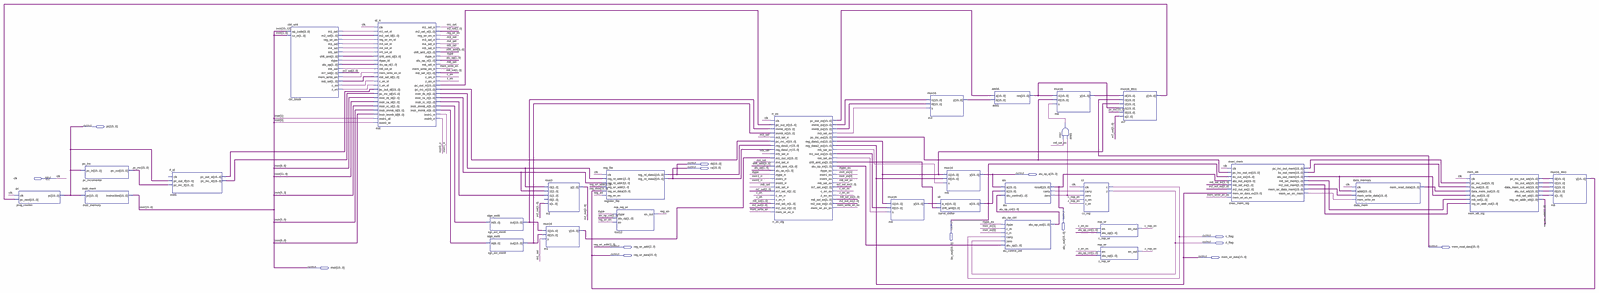
[diagram p0: schematic sheet, whole]
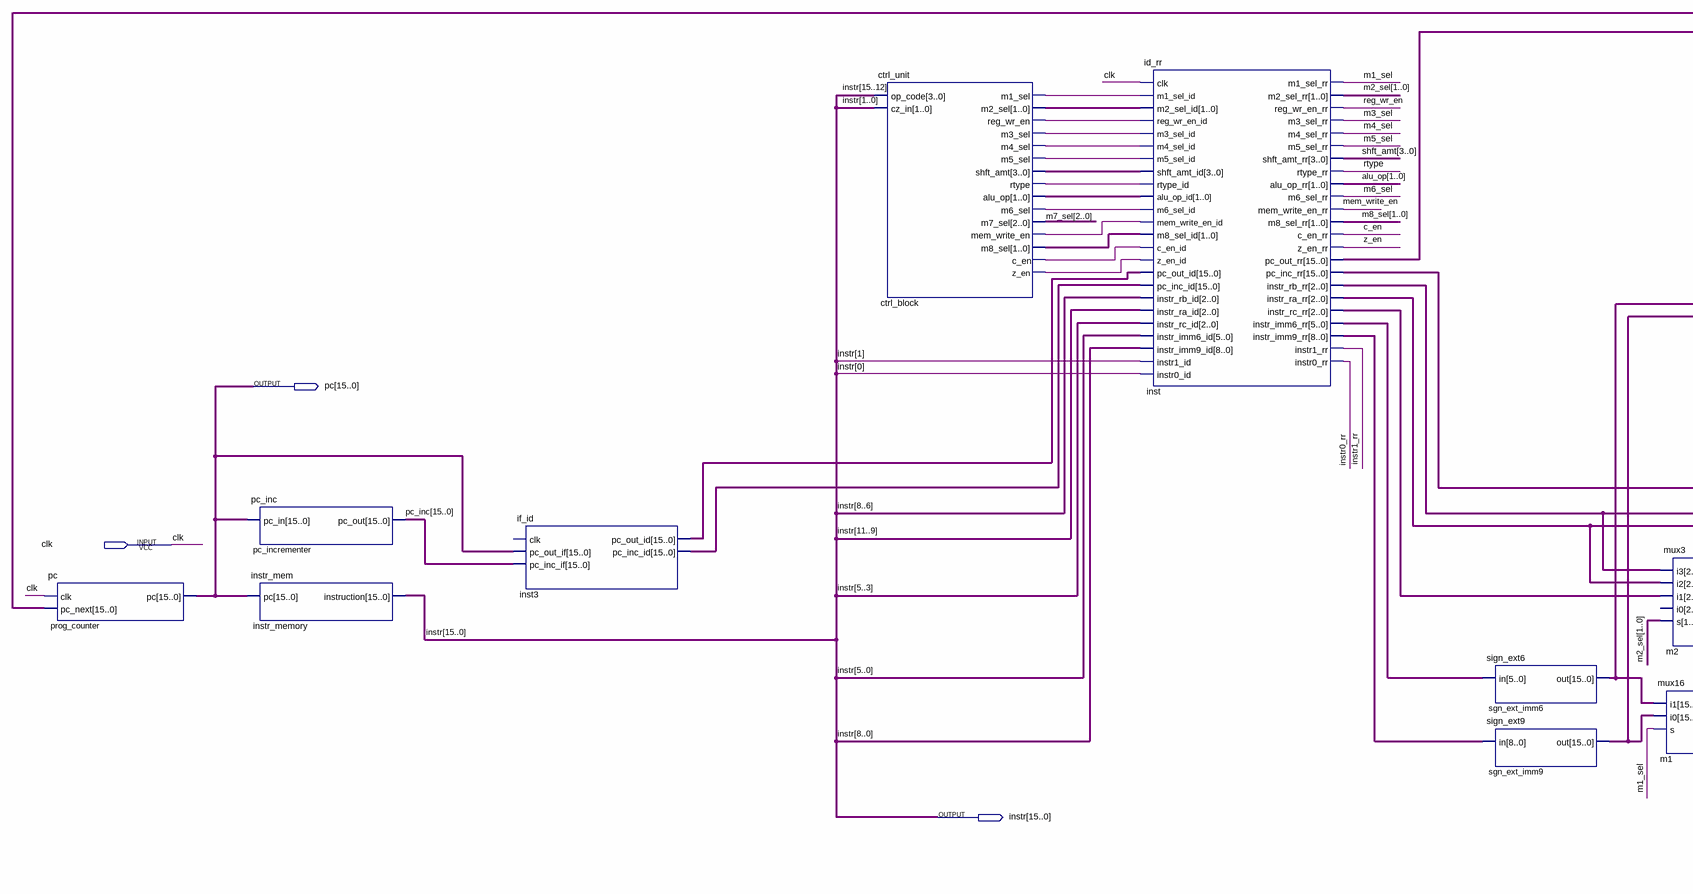
[diagram p1: schematic sheet, left part]
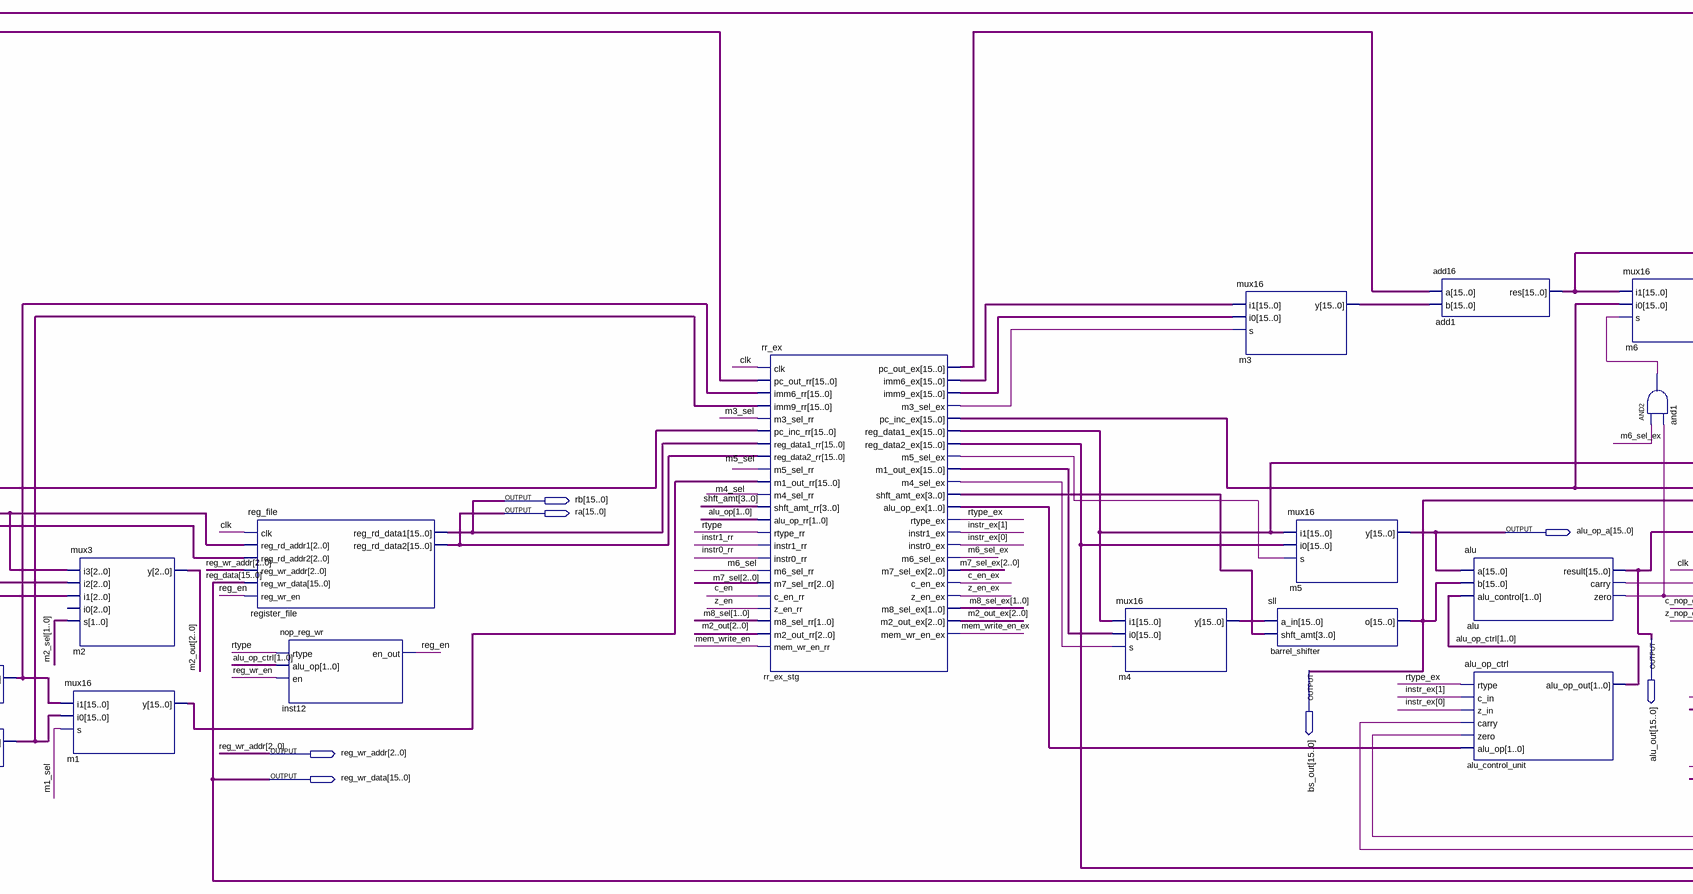
[diagram p2: schematic sheet, centre part]
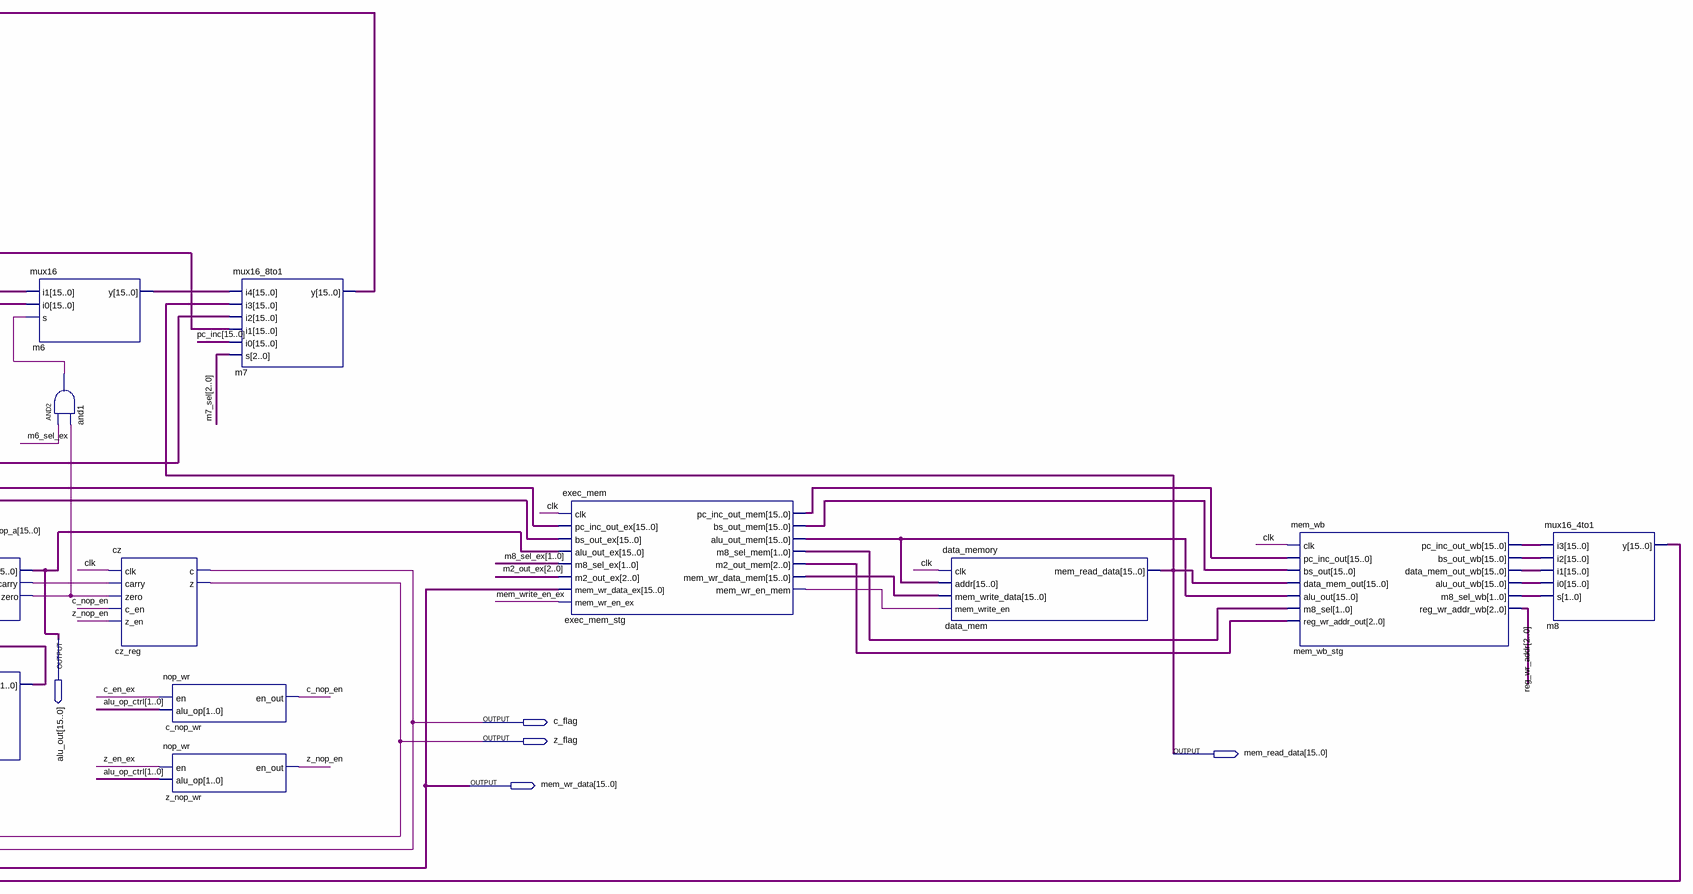
[diagram p3: schematic sheet, right part]
// Quartus schematic pd_project1.bdf as structural Verilog: 30 symbols, 14 pins
module pd_project1 (
  input  clk,
  output [15:0] pc,
  output [15:0] rb,
  output [15:0] ra,
  output [15:0] alu_op_a,
  output [15:0] alu_out,
  output [15:0] bs_out,
  output c_flag,
  output z_flag,
  output [2:0] reg_wr_addr,
  output [15:0] mem_read_data,
  output [15:0] reg_wr_data,
  output [15:0] mem_wr_data,
  output [15:0] instr
);

  wire alu_carry, alu_zero, and1_out, c_en, c_en_ex, c_nop_en, ctrl_block_c_en, ctrl_block_m1_sel,
       ctrl_block_m3_sel, ctrl_block_m4_sel, ctrl_block_m5_sel, ctrl_block_m6_sel, ctrl_block_mem_write_en,
       ctrl_block_reg_wr_en, ctrl_block_rtype, ctrl_block_z_en, exec_mem_stg_mem_wr_en_mem, instr0_rr,
       instr1_rr, m1_sel, m3_sel, m4_sel, m5_sel, m6_sel, m6_sel_ex, mem_write_en, mem_write_en_ex, reg_en,
       reg_wr_en, rr_ex_stg_m3_sel_ex, rr_ex_stg_m4_sel_ex, rr_ex_stg_m5_sel_ex, rtype, rtype_ex, z_en,
       z_en_ex, z_nop_en;
  wire [1:0] alu_op, alu_op_ctrl, ctrl_block_alu_op, ctrl_block_m2_sel, ctrl_block_m8_sel,
       exec_mem_stg_m8_sel_mem, instr_ex, m2_sel, m8_sel, m8_sel_ex, mem_wb_stg_m8_sel_wb,
       rr_ex_stg_alu_op_ex;
  wire [2:0] exec_mem_stg_m2_out_mem, inst_instr_ra_rr, inst_instr_rb_rr, inst_instr_rc_rr, m2_out,
       m2_out_ex, m7_sel, m7_sel_ex;
  wire [3:0] ctrl_block_shft_amt, rr_ex_stg_shft_amt_ex, shft_amt;
  wire [5:0] inst_instr_imm6_rr;
  wire [8:0] inst_instr_imm9_rr;
  wire [15:0] add1_res, exec_mem_stg_alu_out_mem, exec_mem_stg_bs_out_mem, exec_mem_stg_mem_wr_data_mem,
       exec_mem_stg_pc_inc_out_mem, inst3_pc_inc_id, inst3_pc_out_id, inst_pc_inc_rr, inst_pc_out_rr, m1_y,
       m3_y, m4_y, m6_y, m7_y, mem_wb_stg_alu_out_wb, mem_wb_stg_bs_out_wb, mem_wb_stg_data_mem_out_wb,
       mem_wb_stg_pc_inc_out_wb, pc_inc, rr_ex_stg_imm6_ex, rr_ex_stg_imm9_ex, rr_ex_stg_m1_out_ex,
       rr_ex_stg_pc_inc_ex, rr_ex_stg_pc_out_ex, rr_ex_stg_reg_data1_ex, sgn_ext_imm6_out, sgn_ext_imm9_out;

  pc prog_counter (.clk(clk), .pc_next(m7_y), .pc(pc));
  pc_inc pc_incrementer (.pc_in(pc), .pc_out(pc_inc));
  instr_mem instr_memory (.pc(pc), .instruction(instr));
  if_id inst3 (
    .pc_out_if(pc), .pc_inc_if(pc_inc), .pc_out_id(inst3_pc_out_id), .pc_inc_id(inst3_pc_inc_id));  // open: clk
  ctrl_unit ctrl_block (
    .op_code(instr[15:12]), .cz_in(instr[1:0]), .m1_sel(ctrl_block_m1_sel), .m2_sel(ctrl_block_m2_sel),
    .reg_wr_en(ctrl_block_reg_wr_en), .m3_sel(ctrl_block_m3_sel), .m4_sel(ctrl_block_m4_sel),
    .m5_sel(ctrl_block_m5_sel), .shft_amt(ctrl_block_shft_amt), .rtype(ctrl_block_rtype),
    .alu_op(ctrl_block_alu_op), .m6_sel(ctrl_block_m6_sel), .m7_sel(m7_sel),
    .mem_write_en(ctrl_block_mem_write_en), .m8_sel(ctrl_block_m8_sel), .c_en(ctrl_block_c_en),
    .z_en(ctrl_block_z_en));
  id_rr inst (
    .clk(clk), .m1_sel_id(ctrl_block_m1_sel), .m2_sel_id(ctrl_block_m2_sel),
    .reg_wr_en_id(ctrl_block_reg_wr_en), .m3_sel_id(ctrl_block_m3_sel), .m4_sel_id(ctrl_block_m4_sel),
    .m5_sel_id(ctrl_block_m5_sel), .shft_amt_id(ctrl_block_shft_amt), .rtype_id(ctrl_block_rtype),
    .alu_op_id(ctrl_block_alu_op), .m6_sel_id(ctrl_block_m6_sel), .mem_write_en_id(ctrl_block_mem_write_en),
    .m8_sel_id(ctrl_block_m8_sel), .c_en_id(ctrl_block_c_en), .z_en_id(ctrl_block_z_en),
    .pc_out_id(inst3_pc_out_id), .pc_inc_id(inst3_pc_inc_id), .instr_rb_id(instr[8:6]),
    .instr_ra_id(instr[11:9]), .instr_rc_id(instr[5:3]), .instr_imm6_id(instr[5:0]),
    .instr_imm9_id(instr[8:0]), .instr1_id(instr[1]), .instr0_id(instr[0]), .m1_sel_rr(m1_sel),
    .m2_sel_rr(m2_sel), .reg_wr_en_rr(reg_wr_en), .m3_sel_rr(m3_sel), .m4_sel_rr(m4_sel), .m5_sel_rr(m5_sel),
    .shft_amt_rr(shft_amt), .rtype_rr(rtype), .alu_op_rr(alu_op), .m6_sel_rr(m6_sel),
    .mem_write_en_rr(mem_write_en), .m8_sel_rr(m8_sel), .c_en_rr(c_en), .z_en_rr(z_en),
    .pc_out_rr(inst_pc_out_rr), .pc_inc_rr(inst_pc_inc_rr), .instr_rb_rr(inst_instr_rb_rr),
    .instr_ra_rr(inst_instr_ra_rr), .instr_rc_rr(inst_instr_rc_rr), .instr_imm6_rr(inst_instr_imm6_rr),
    .instr_imm9_rr(inst_instr_imm9_rr), .instr1_rr(instr1_rr), .instr0_rr(instr0_rr));
  sign_ext6 sgn_ext_imm6 (.in(inst_instr_imm6_rr), .out(sgn_ext_imm6_out));
  sign_ext9 sgn_ext_imm9 (.in(inst_instr_imm9_rr), .out(sgn_ext_imm9_out));
  mux3 m2 (.i3(inst_instr_rb_rr), .i2(inst_instr_ra_rr), .i1(inst_instr_rc_rr), .s(m2_sel), .y(m2_out));  // open: i0
  mux16 m1 (.i1(sgn_ext_imm6_out), .i0(sgn_ext_imm9_out), .s(m1_sel), .y(m1_y));
  reg_file register_file (
    .clk(clk), .reg_rd_addr1(inst_instr_rb_rr), .reg_rd_addr2(inst_instr_ra_rr), .reg_wr_addr(reg_wr_addr),
    .reg_wr_data(reg_wr_data), .reg_wr_en(reg_en), .reg_rd_data1(rb), .reg_rd_data2(ra));
  nop_reg_wr inst12 (.rtype(rtype), .alu_op(alu_op_ctrl), .en(reg_wr_en), .en_out(reg_en));
  rr_ex rr_ex_stg (
    .clk(clk), .pc_out_rr(inst_pc_out_rr), .imm6_rr(sgn_ext_imm6_out), .imm9_rr(sgn_ext_imm9_out),
    .m3_sel_rr(m3_sel), .pc_inc_rr(inst_pc_inc_rr), .reg_data1_rr(rb), .reg_data2_rr(ra), .m5_sel_rr(m5_sel),
    .m1_out_rr(m1_y), .m4_sel_rr(m4_sel), .shft_amt_rr(shft_amt), .alu_op_rr(alu_op), .rtype_rr(rtype),
    .instr1_rr(instr1_rr), .instr0_rr(instr0_rr), .m6_sel_rr(m6_sel), .m7_sel_rr(m7_sel), .c_en_rr(c_en),
    .z_en_rr(z_en), .m8_sel_rr(m8_sel), .m2_out_rr(m2_out), .mem_wr_en_rr(mem_write_en),
    .pc_out_ex(rr_ex_stg_pc_out_ex), .imm6_ex(rr_ex_stg_imm6_ex), .imm9_ex(rr_ex_stg_imm9_ex),
    .m3_sel_ex(rr_ex_stg_m3_sel_ex), .pc_inc_ex(rr_ex_stg_pc_inc_ex), .reg_data1_ex(rr_ex_stg_reg_data1_ex),
    .reg_data2_ex(mem_wr_data), .m5_sel_ex(rr_ex_stg_m5_sel_ex), .m1_out_ex(rr_ex_stg_m1_out_ex),
    .m4_sel_ex(rr_ex_stg_m4_sel_ex), .shft_amt_ex(rr_ex_stg_shft_amt_ex), .alu_op_ex(rr_ex_stg_alu_op_ex),
    .rtype_ex(rtype_ex), .instr1_ex(instr_ex[1]), .instr0_ex(instr_ex[0]), .m6_sel_ex(m6_sel_ex),
    .m7_sel_ex(m7_sel_ex), .c_en_ex(c_en_ex), .z_en_ex(z_en_ex), .m8_sel_ex(m8_sel_ex),
    .m2_out_ex(m2_out_ex), .mem_wr_en_ex(mem_write_en_ex));
  mux16 m4 (.i1(rr_ex_stg_reg_data1_ex), .i0(rr_ex_stg_m1_out_ex), .s(rr_ex_stg_m4_sel_ex), .y(m4_y));
  mux16 m3 (.i1(rr_ex_stg_imm6_ex), .i0(rr_ex_stg_imm9_ex), .s(rr_ex_stg_m3_sel_ex), .y(m3_y));
  mux16 m5 (.i1(rr_ex_stg_reg_data1_ex), .i0(mem_wr_data), .s(rr_ex_stg_m5_sel_ex), .y(alu_op_a));
  sll barrel_shifter (.a_in(m4_y), .shft_amt(rr_ex_stg_shft_amt_ex), .o(bs_out));
  add16 add1 (.a(rr_ex_stg_pc_out_ex), .b(m3_y), .res(add1_res));
  alu alu (.a(alu_op_a), .b(bs_out), .alu_control(alu_op_ctrl), .result(alu_out), .carry(alu_carry), .zero(alu_zero));
  alu_op_ctrl alu_control_unit (
    .rtype(rtype_ex), .c_in(instr_ex[1]), .z_in(instr_ex[0]), .carry(c_flag), .zero(z_flag),
    .alu_op(rr_ex_stg_alu_op_ex), .alu_op_out(alu_op_ctrl));
  mux16 m6 (.i1(add1_res), .i0(rr_ex_stg_pc_inc_ex), .s(and1_out), .y(m6_y));
  and and1 (and1_out, m6_sel_ex, alu_zero);
  cz cz_reg (.clk(clk), .carry(alu_carry), .zero(alu_zero), .c_en(c_nop_en), .z_en(z_nop_en), .c(c_flag), .z(z_flag));
  nop_wr c_nop_wr (.en(c_en_ex), .alu_op(alu_op_ctrl), .en_out(c_nop_en));
  nop_wr z_nop_wr (.en(z_en_ex), .alu_op(alu_op_ctrl), .en_out(z_nop_en));
  mux16_8to1 m7 (
    .i4(m6_y), .i3(mem_read_data), .i2(rr_ex_stg_reg_data1_ex), .i1(add1_res), .i0(pc_inc), .s(m7_sel),
    .y(m7_y));
  exec_mem exec_mem_stg (
    .clk(clk), .pc_inc_out_ex(rr_ex_stg_pc_inc_ex), .bs_out_ex(bs_out), .alu_out_ex(alu_out),
    .m8_sel_ex(m8_sel_ex), .m2_out_ex(m2_out_ex), .mem_wr_data_ex(mem_wr_data),
    .mem_wr_en_ex(mem_write_en_ex), .pc_inc_out_mem(exec_mem_stg_pc_inc_out_mem),
    .bs_out_mem(exec_mem_stg_bs_out_mem), .alu_out_mem(exec_mem_stg_alu_out_mem),
    .m8_sel_mem(exec_mem_stg_m8_sel_mem), .m2_out_mem(exec_mem_stg_m2_out_mem),
    .mem_wr_data_mem(exec_mem_stg_mem_wr_data_mem), .mem_wr_en_mem(exec_mem_stg_mem_wr_en_mem));
  data_memory data_mem (
    .clk(clk), .addr(exec_mem_stg_alu_out_mem), .mem_write_data(exec_mem_stg_mem_wr_data_mem),
    .mem_write_en(exec_mem_stg_mem_wr_en_mem), .mem_read_data(mem_read_data));
  mem_wb mem_wb_stg (
    .clk(clk), .pc_inc_out(exec_mem_stg_pc_inc_out_mem), .bs_out(exec_mem_stg_bs_out_mem),
    .data_mem_out(mem_read_data), .alu_out(exec_mem_stg_alu_out_mem), .m8_sel(exec_mem_stg_m8_sel_mem),
    .reg_wr_addr_out(exec_mem_stg_m2_out_mem), .pc_inc_out_wb(mem_wb_stg_pc_inc_out_wb),
    .bs_out_wb(mem_wb_stg_bs_out_wb), .data_mem_out_wb(mem_wb_stg_data_mem_out_wb),
    .alu_out_wb(mem_wb_stg_alu_out_wb), .m8_sel_wb(mem_wb_stg_m8_sel_wb), .reg_wr_addr_wb(reg_wr_addr));
  mux16_4to1 m8 (
    .i3(mem_wb_stg_pc_inc_out_wb), .i2(mem_wb_stg_bs_out_wb), .i1(mem_wb_stg_data_mem_out_wb),
    .i0(mem_wb_stg_alu_out_wb), .s(mem_wb_stg_m8_sel_wb), .y(reg_wr_data));

  // Other names for the same wires on the sheet: reg_data[15:0] = reg_wr_data
endmodule
